# EasyEDA schematic EuclidSeqNano_2020-09-19_20-01-49.json
TITLE: EuclidSeqNano; REV: 1.0; Date: 2020-09-18; Sheet: 1/1; Drawn By: JVeen
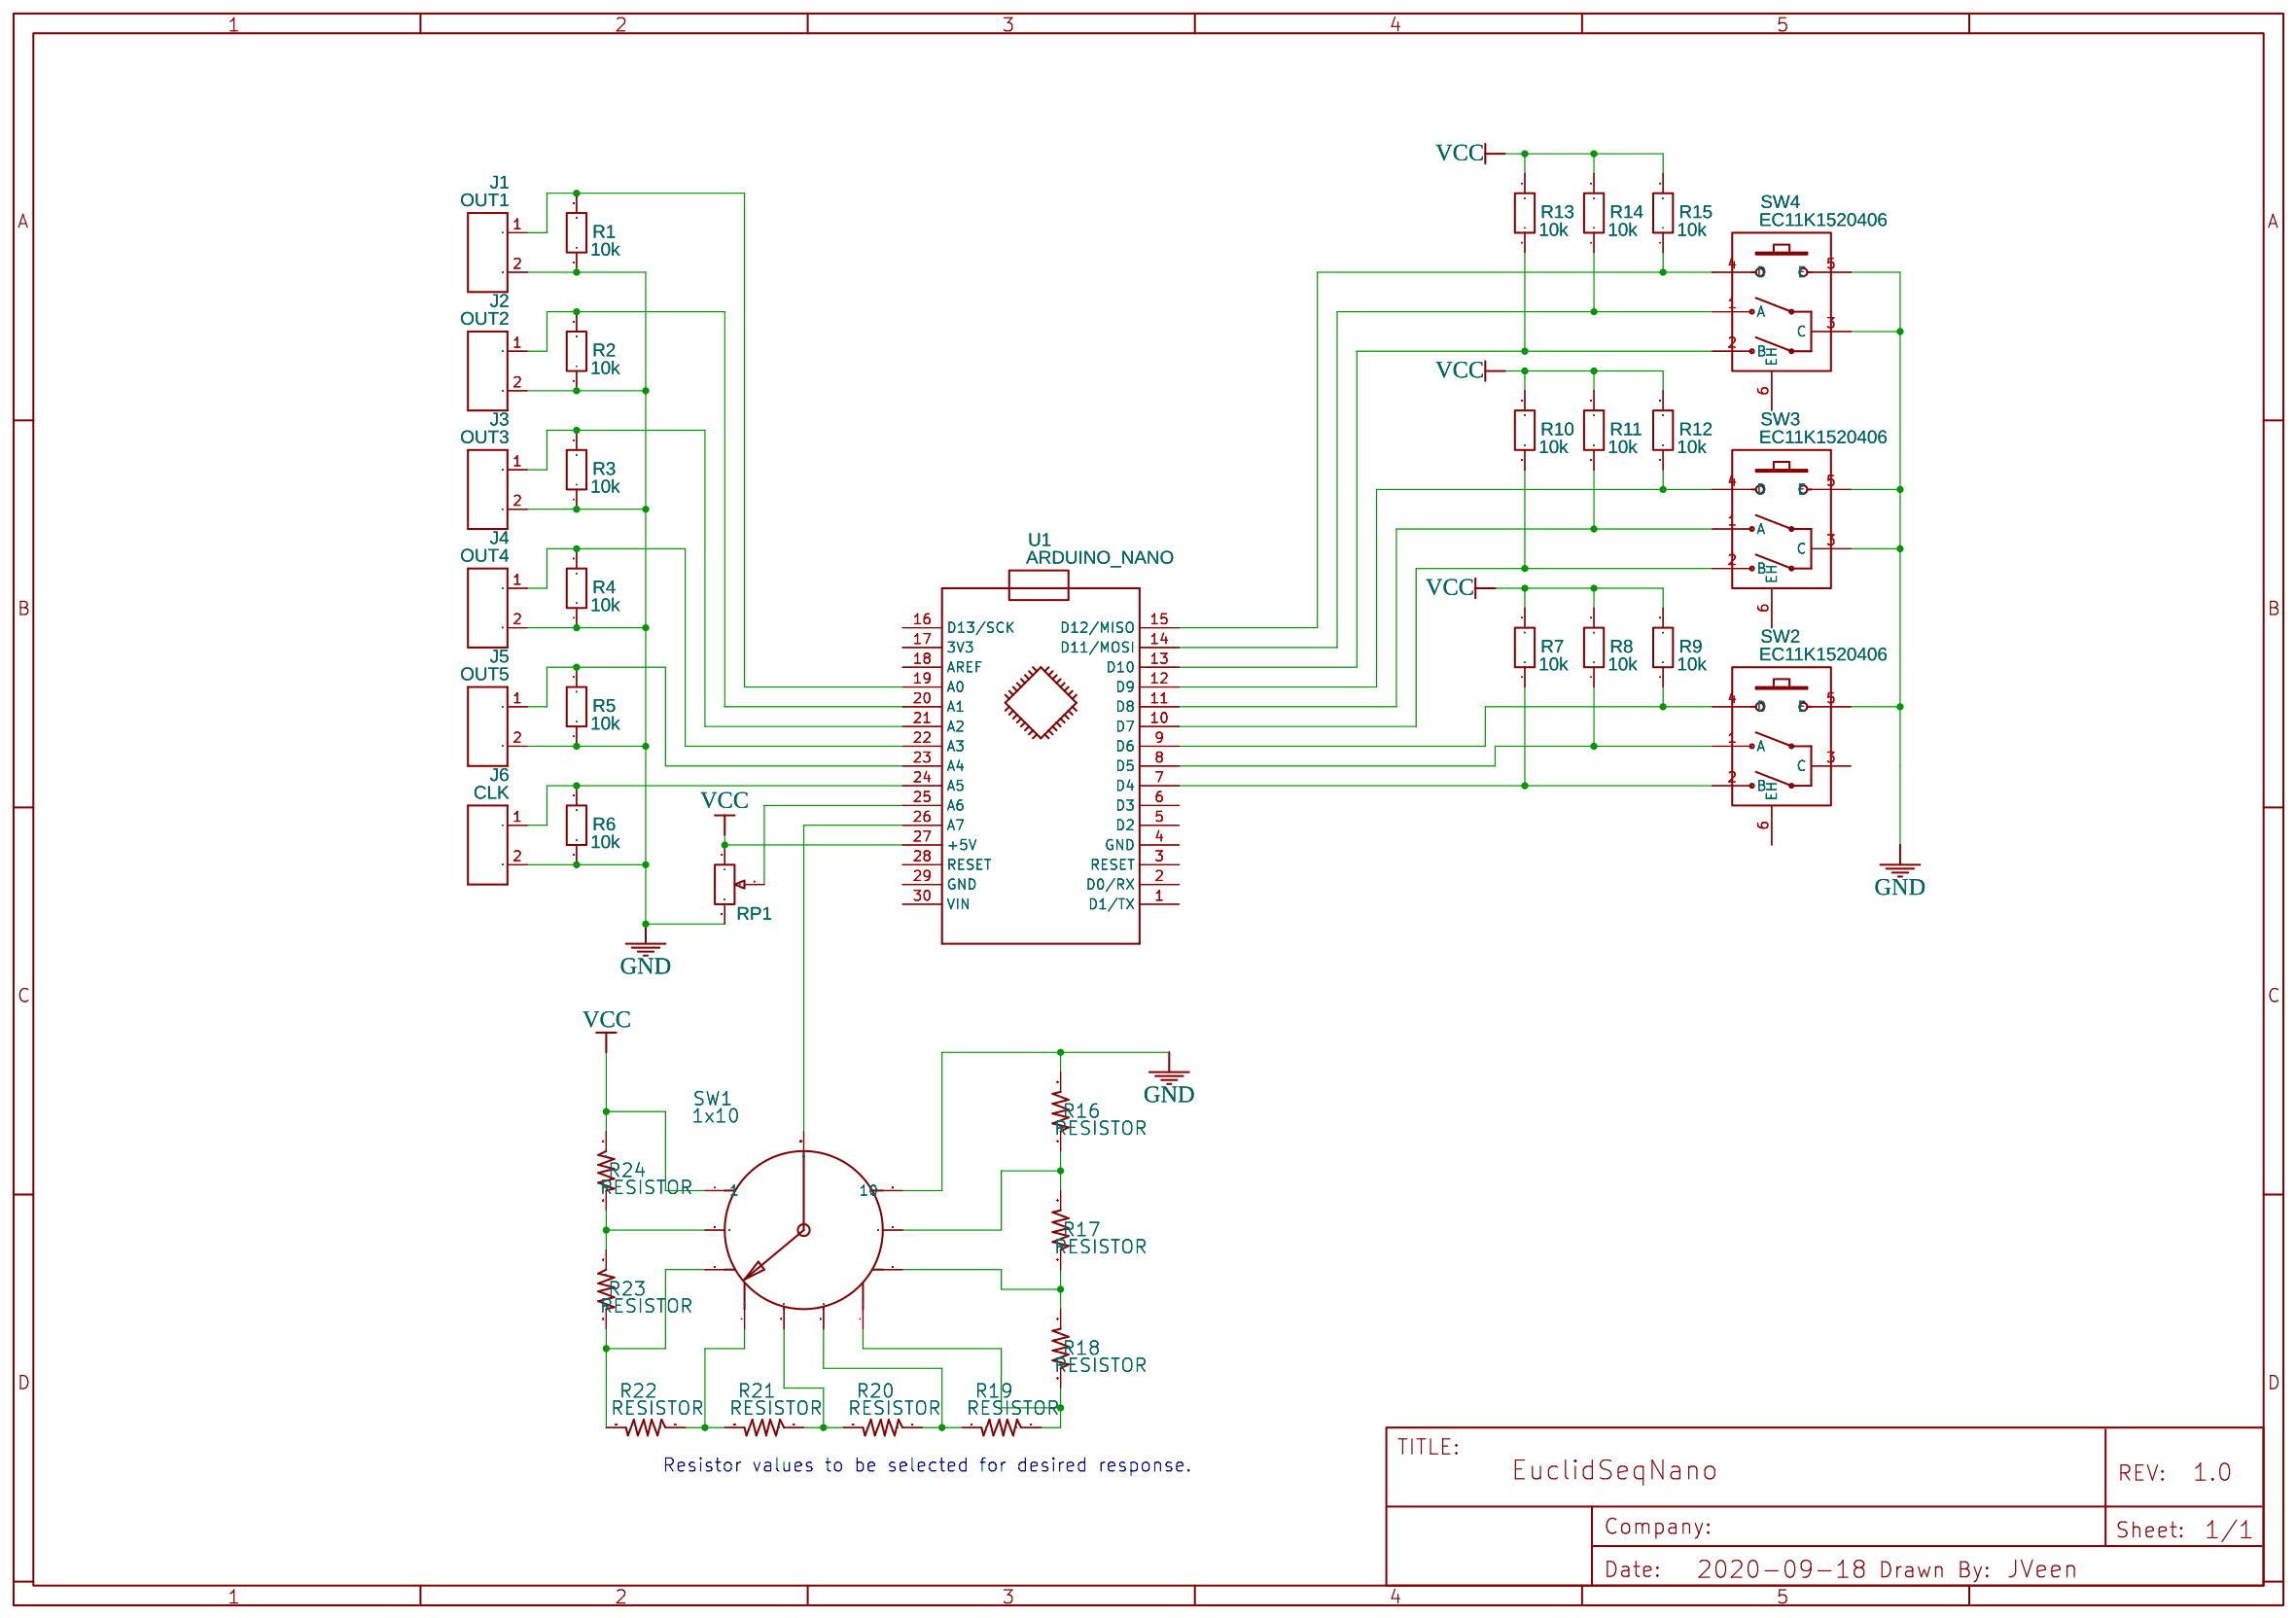
[diagram p0: schematic sheet]

## Parts
J1  OUT1  [H2-5.0-10.5X8.0MM]
J2  OUT2  [H2-5.0-10.5X8.0MM]
J3  OUT3  [H2-5.0-10.5X8.0MM]
J4  OUT4  [H2-5.0-10.5X8.0MM]
J5  OUT5  [H2-5.0-10.5X8.0MM]
J6  CLK  [H2-5.0-10.5X8.0MM]
R1  10k  [R0603]
R2  10k  [R0603]
R3  10k  [R0603]
R4  10k  [R0603]
R5  10k  [R0603]
R6  10k  [R0603]
R7  10k  [R0603]
R8  10k  [R0603]
R9  10k  [R0603]
R10  10k  [R0603]
R11  10k  [R0603]
R12  10k  [R0603]
R13  10k  [R0603]
R14  10k  [R0603]
R15  10k  [R0603]
R16  RESISTOR  [AXIAL-0.1EZ]
R17  RESISTOR  [AXIAL-0.1EZ]
R18  RESISTOR  [AXIAL-0.1EZ]
R19  RESISTOR  [AXIAL-0.1EZ]
R20  RESISTOR  [AXIAL-0.1EZ]
R21  RESISTOR  [AXIAL-0.1EZ]
R22  RESISTOR  [AXIAL-0.1EZ]
R23  RESISTOR  [AXIAL-0.1EZ]
R24  RESISTOR  [AXIAL-0.1EZ]
RP1  R_3386P_EU  [RES-ADJ-TH_3386P]
SW1  1x10  [ROTARY_SWITCH_1X10_KIT]
SW2  EC11K1520406  [SW-TH_EC11K0924404]
SW3  EC11K1520406  [SW-TH_EC11K0924404]
SW4  EC11K1520406  [SW-TH_EC11K0924404]
U1  ARDUINO_NANO  [ARDUINO_NANO]

## Library data of the parts
J1-J6 = -: Screw Terminal; Manufacturer Part: ?
R1-R15 = R_0603_EU: Contributor: LCEDA_Lib
R24 = -: Package Display: No
RP1 = R_3386P_EU: Supplier: LCSC; Contributor: LCEDA_Lib; Value(Ω): 10K
SW2-SW4 = EC11K1520406: Supplier: LCSC; Supplier Part: C470721; Manufacturer: ALPS Electric; Contributor: LCSC
U1 = -: sourceId: KGSeAWhDB; Manufacturer Part: ?

## Nets
GND: J1.2 J2.2 J3.2 J4.2 J5.2 J6.2 R1.1 R2.1 R3.1 R4.1 R5.1 R6.1 R16.P$2(2) RP1.3 SW1.10 SW2.5(E) SW3.3(C) SW3.5(E) SW4.3(C) SW4.5(E)
VCC: R7.2 R8.2 R9.2 R10.2 R11.2 R12.2 R13.2 R14.2 R15.2 R24.P$1(1) RP1.1 SW1.1 U1.27(+5V)
Net-(J1-1): J1.1 R1.2 U1.19(A0)
Net-(J2-1): J2.1 R2.2 U1.20(A1)
Net-(J3-1): J3.1 R3.2 U1.21(A2)
Net-(J4-1): J4.1 R4.2 U1.22(A3)
Net-(J5-1): J5.1 R5.2 U1.23(A4)
Net-(J6-1): J6.1 R6.2 U1.24(A5)
Net-(R7-1): R7.1 SW2.2(B) U1.7(D4)
Net-(R8-1): R8.1 SW2.1(A) U1.8(D5)
Net-(R9-1): R9.1 SW2.4(D) U1.9(D6)
Net-(R10-1): R10.1 SW3.2(B) U1.10(D7)
Net-(R11-1): R11.1 SW3.1(A) U1.11(D8)
Net-(R12-1): R12.1 SW3.4(D) U1.12(D9)
Net-(R13-1): R13.1 SW4.2(B) U1.13(D10)
Net-(R14-1): R14.1 SW4.1(A) U1.14(D11/MOSI)
Net-(R15-1): R15.1 SW4.4(D) U1.15(D12/MISO)
Net-(R16-P$1): R16.P$1(1) R17.P$2(2) SW1.9
Net-(R17-P$1): R17.P$1(1) R18.P$2(2) SW1.8
Net-(R18-P$1): R18.P$1(1) R19.P$1(1) SW1.7
Net-(R19-P$2): R19.P$2(2) R20.P$1(1) SW1.6
Net-(R20-P$2): R20.P$2(2) R21.P$1(1) SW1.5
Net-(R21-P$2): R21.P$2(2) R22.P$1(1) SW1.4
Net-(R22-P$2): R22.P$2(2) R23.P$2(2) SW1.3
Net-(R23-P$1): R23.P$1(1) R24.P$2(2) SW1.2
Net-(RP1-2): RP1.2 U1.25(A6)
Net-(SW1-COMMON): SW1.COMMON U1.26(A7)

Not connected (* = marked no-connect by the designer): SW2 3(C) 6(EH); SW3 6(EH); SW4 6(EH); U1 1(D1/TX) 2(D0/RX) 3(RESET) 4(GND) 5(D2) 6(D3) 16(D13/SCK) 17(3V3) 18(AREF) 28(RESET) 29(GND) 30(VIN)

## Notes on the sheet
- Resistor values to be selected for desired response.
